# Altium schematic sheet RS485_M_V1.SchDoc
size A4
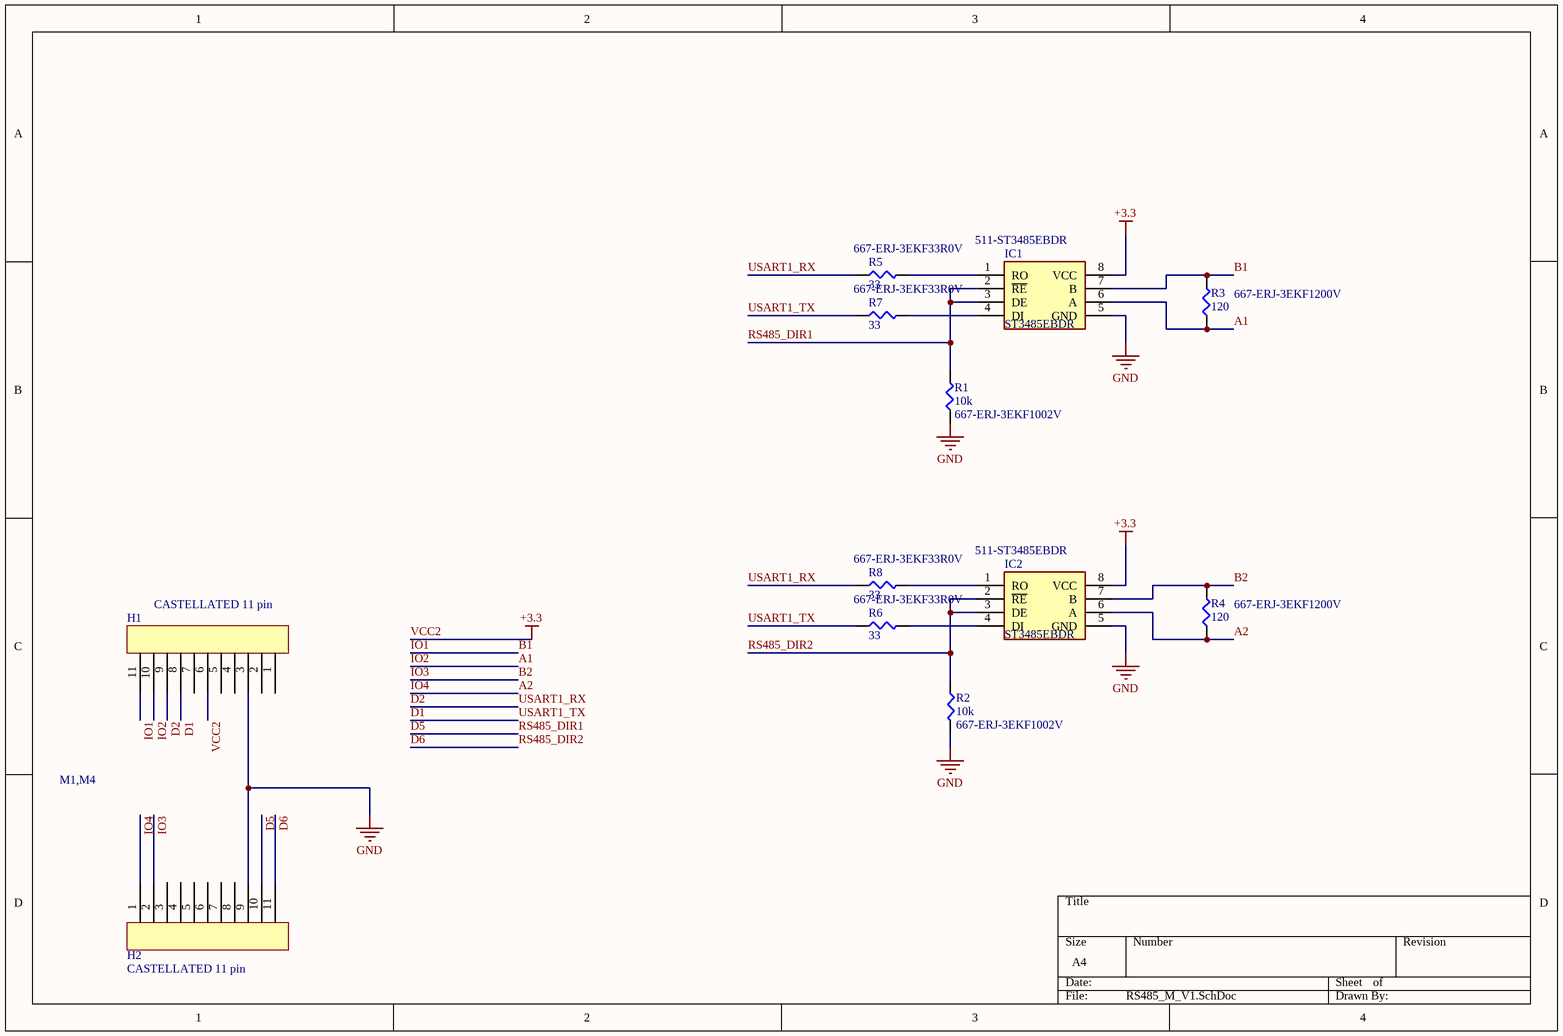
[diagram p0: RS485_M_V1.SchDoc]

## Parts
H1  CASTELLATED 11 pin  [CASTELLATED 11 pin]
H2  CASTELLATED 11 pin  [CASTELLATED 11 pin]
IC1  ST3485EBDR  Supplier Part Number 1: 511-ST3485EBDR  [SOIC127P600X175-8N]
IC2  ST3485EBDR  Supplier Part Number 1: 511-ST3485EBDR  [SOIC127P600X175-8N]
R1  10k  Supplier Part Number 1: 667-ERJ-3EKF1002V  [SMD-0603-RES]
R2  10k  Supplier Part Number 1: 667-ERJ-3EKF1002V  [SMD-0603-RES]
R3  120  Supplier Part Number 1: 667-ERJ-3EKF1200V  [SMD-0603-RES]
R4  120  Supplier Part Number 1: 667-ERJ-3EKF1200V  [SMD-0603-RES]
R5  33  Supplier Part Number 1: 667-ERJ-3EKF33R0V  [SMD-0603-RES]
R6  33  Supplier Part Number 1: 667-ERJ-3EKF33R0V  [SMD-0603-RES]
R7  33  Supplier Part Number 1: 667-ERJ-3EKF33R0V  [SMD-0603-RES]
R8  33  Supplier Part Number 1: 667-ERJ-3EKF33R0V  [SMD-0603-RES]

## Nets
GND: H1.3 H2.9 IC1.5(GND) IC2.5(GND) R1.1 R2.2
VCC2: H1.6 IC1.8(VCC) IC2.8(VCC)  [also labelled +3.3]
A1: H1.10 IC1.6(A) R3.1  [also labelled IO2]
A2: H2.1 IC2.6(A) R4.1  [also labelled IO4]
B1: H1.11 IC1.7(B) R3.2  [also labelled IO1]
B2: H2.2 IC2.7(B) R4.2  [also labelled IO3]
D1: H1.8 R6.1 R7.1  [also labelled USART1_TX]
D2: H1.9 R5.1 R8.1  [also labelled USART1_RX]
D5: H2.10 IC1.2(~{RE}) IC1.3(DE) R1.2  [also labelled RS485_DIR1]
D6: H2.11 IC2.2(~{RE}) IC2.3(DE) R2.1  [also labelled RS485_DIR2]
NetIC1_1: IC1.1(RO) R5.2
NetIC1_4: IC1.4(DI) R7.2
NetIC2_1: IC2.1(RO) R8.2
NetIC2_4: IC2.4(DI) R6.2

Not connected (* = marked no-connect by the designer): H1 1 2 4 5 7; H2 3 4 5 6 7 8

## Notes on the sheet
- M1,M4

## Library data of the parts
IC1 IC2 = ST3485EBDR: Integrated Circuit; Manufacturer_Name: STMicroelectronics; Datasheet Link: https://componentsearchengine.com/Datasheets/1/ST3485EBDR.pdf; Height: 1.75mm; Mouser2 Part Number: 511-ST3485EBDR; Mouser2 Price/Stock: https://www.mouser.com/Search/Refine.aspx?Keyword=511-ST3485EBDR; Manufacturer_Part_Number: ST3485EBDR; Supplier 1: Mouser
R1 R2 = ERJ-3EKF1002V: RES SMD 10K OHM 1% 1/10W 0603; Manufacturer: Panasonic Electronic Components; Factory Stock: 0; Unit Price (USD): 0.00379; @ qty: 1500; Minimum Quantity: 1; Power (Watts): 0.1W, 1/10W; Temperature Coefficient: ±100ppm/°C; Part Number: ERJ-3EKF1002V; Datasheets: http://industrial.panasonic.com/www-cgi/jvcr13pz.cgi?E+PZ+3+AOA0002+ERJ3EKF1002V+7+WW; Image: //media.digikey.com/Photos/Panasonic%20Photos/MFG_ERJ-P6W%20Series.jpg; Digi-Key Part Number: P10.0KHCT-ND; Quantity Available: 6703141; Packaging: Cut Tape (CT); Series: ERJ; Part Status: Active; Value: 10k; Tolerance: ±1%; Composition: Thick Film; Features: Automotive AEC-Q200; Operating Temperature: -55°C ~ 155°C; Package / Case: 0603 (1608 Metric); Supplier Device Package: 0603; Size / Dimension: 0.063" L x 0.031" W (1.60mm x 0.80mm); Height - Seated (Max): 0.022" (0.55mm); Number of Terminations: 2; Failure Rate: -; Supplier 1: Mouser
R3 R4 = ERJ-3EKF1200V: RES SMD 120 OHM 1% 1/10W 0603; Manufacturer: Panasonic Electronic Components; Factory Stock: 0; Unit Price (USD): 0.00379; @ qty: 1500; Minimum Quantity: 1; Power (Watts): 0.1W, 1/10W; Temperature Coefficient: ±100ppm/°C; Part Number: ERJ-3EKF1200V; Datasheets: http://industrial.panasonic.com/www-cgi/jvcr13pz.cgi?E+PZ+3+AOA0002+ERJ3EKF1200V+7+WW; Image: //media.digikey.com/Photos/Panasonic%20Photos/MFG_ERJ-P6W%20Series.jpg; Digi-Key Part Number: P120HCT-ND; Quantity Available: 84623; Packaging: Cut Tape (CT); Series: ERJ; Part Status: Active; Value: 120; Tolerance: ±1%; Composition: Thick Film; Features: Automotive AEC-Q200; Operating Temperature: -55°C ~ 155°C; Package / Case: 0603 (1608 Metric); Supplier Device Package: 0603; Size / Dimension: 0.063" L x 0.031" W (1.60mm x 0.80mm); Height - Seated (Max): 0.022" (0.55mm); Number of Terminations: 2; Failure Rate: -; Supplier 1: Mouser
R5-R8 = ERJ-3EKF33R0V: RES SMD 33 OHM 1% 1/10W 0603; Manufacturer: Panasonic Electronic Components; Factory Stock: 0; Unit Price (USD): 0.00379; @ qty: 1500; Minimum Quantity: 1; Power (Watts): 0.1W, 1/10W; Temperature Coefficient: ±100ppm/°C; Part Number: ERJ-3EKF33R0V; Datasheets: http://industrial.panasonic.com/www-cgi/jvcr13pz.cgi?E+PZ+3+AOA0002+ERJ3EKF33R0V+7+WW; Image: //media.digikey.com/Photos/Panasonic%20Photos/MFG_ERJ-P6W%20Series.jpg; Digi-Key Part Number: P33.0HCT-ND; Quantity Available: 1306721; Packaging: Cut Tape (CT); Series: ERJ; Part Status: Active; Value: 33; Tolerance: ±1%; Composition: Thick Film; Features: Automotive AEC-Q200; Operating Temperature: -55°C ~ 155°C; Package / Case: 0603 (1608 Metric); Supplier Device Package: 0603; Size / Dimension: 0.063" L x 0.031" W (1.60mm x 0.80mm); Height - Seated (Max): 0.022" (0.55mm); Number of Terminations: 2; Failure Rate: -; Supplier 1: Mouser